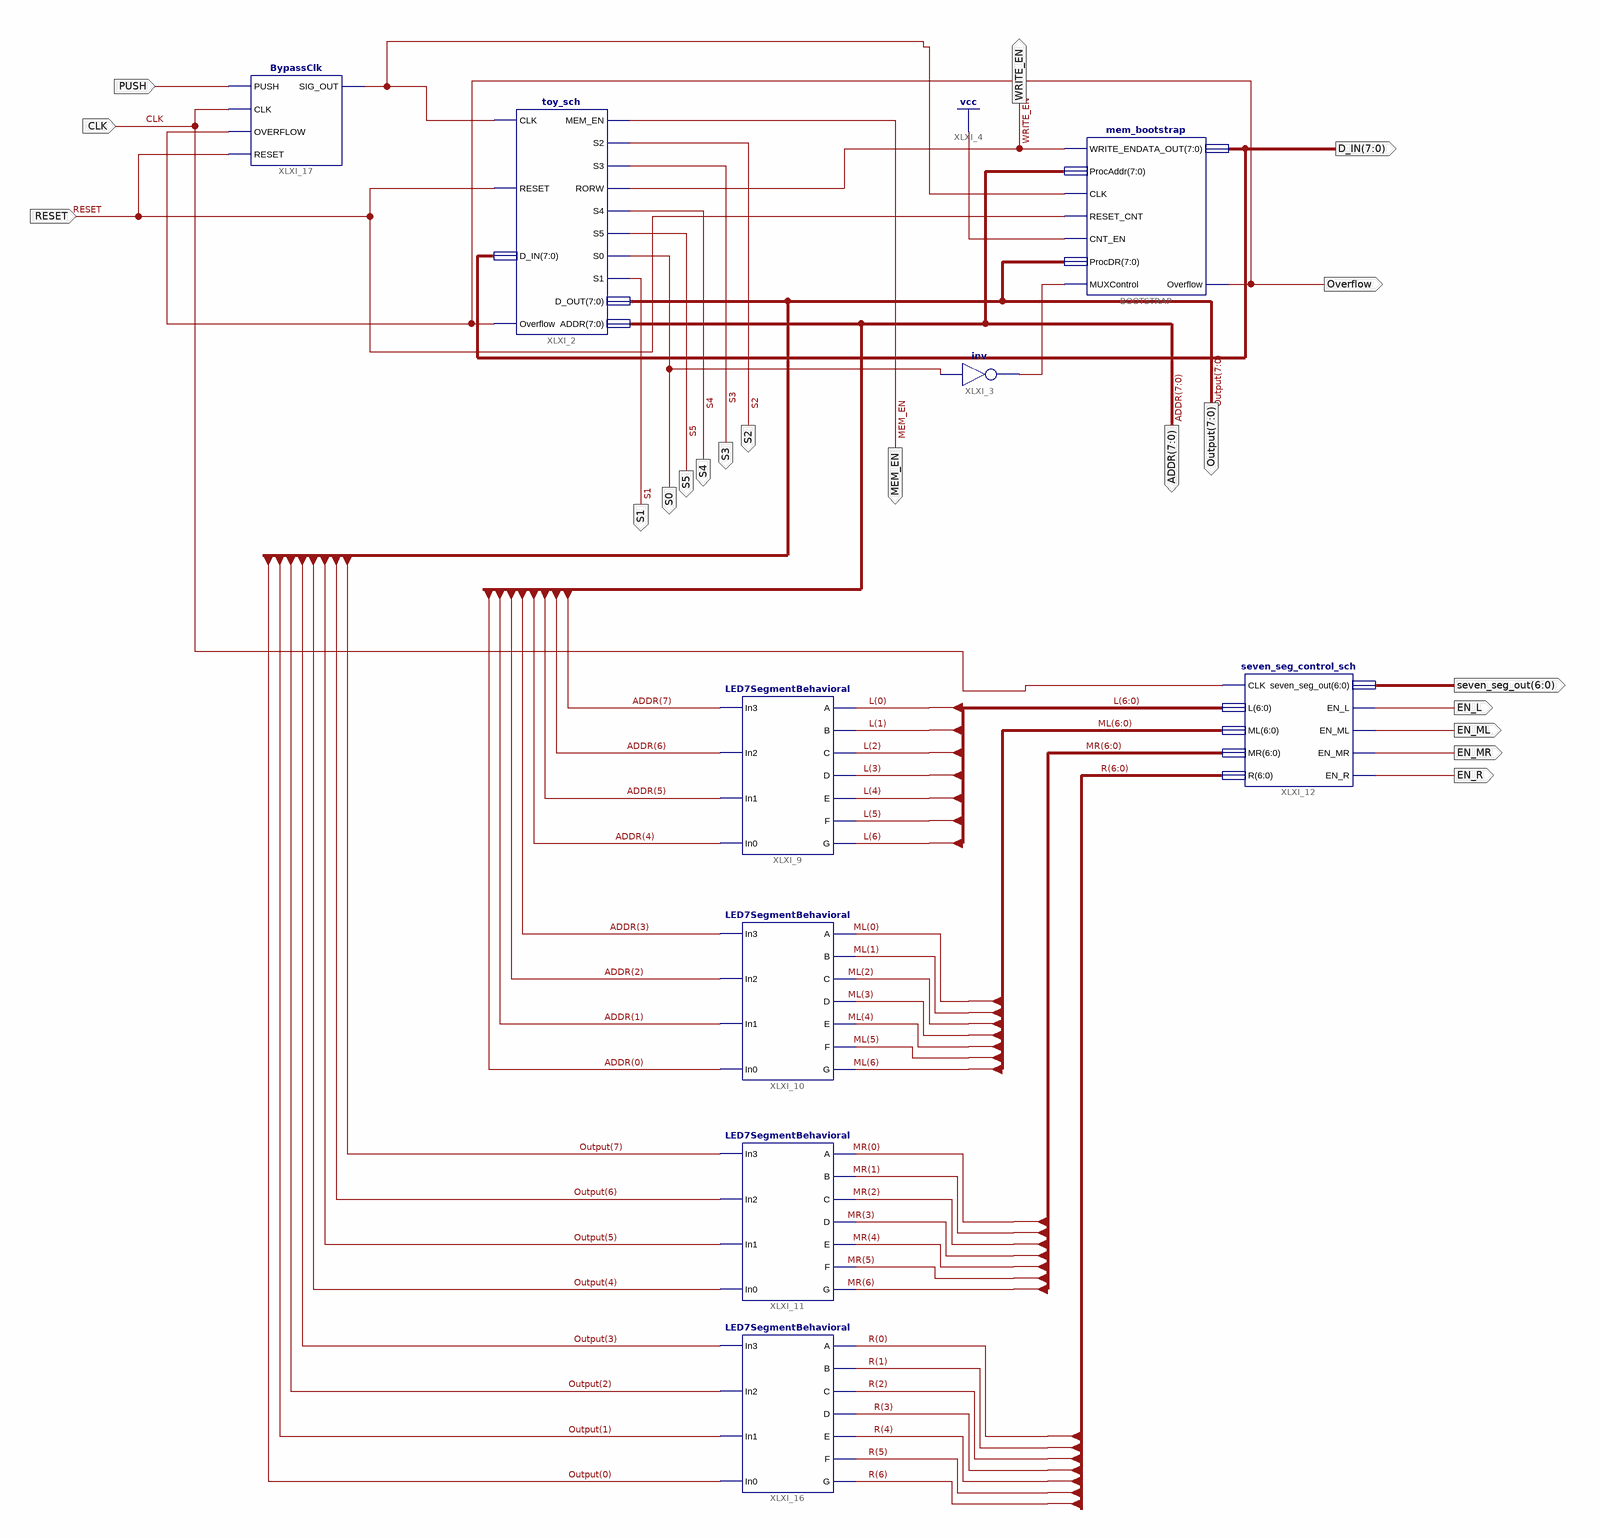
[diagram p0: schematic sheet 1]
// Xilinx ISE schematic toyProcessor_overall.sch (spartan3e) as structural Verilog: 9 symbols, 20 ports
module toyProcessor_overall (
  input  RESET,
  input  CLK,
  input  PUSH,
  output S2,
  output S3,
  output S4,
  output S5,
  output S1,
  output [7:0] ADDR,
  output Overflow,
  output WRITE_EN,
  output MEM_EN,
  output S0,
  output [7:0] D_IN,
  output [6:0] seven_seg_out,
  output EN_L,
  output EN_ML,
  output EN_MR,
  output EN_R,
  output [7:0] Output
);

  wire XLXN_20, XLXN_174;
  wire [6:0] L, ML, MR, R;

  BypassClk XLXI_17 (.CLK(CLK), .OVERFLOW(Overflow), .PUSH(PUSH), .RESET(RESET), .SIG_OUT(XLXN_174));
  mem_bootstrap BOOTSTRAP (
    .WRITE_EN(WRITE_EN), .ProcAddr(ADDR), .CLK(XLXN_174), .RESET_CNT(RESET), .CNT_EN(1'b1), .ProcDR(Output),
    .MUXControl(XLXN_20), .DATA_OUT(D_IN), .Overflow(Overflow));
  toy_sch XLXI_2 (
    .CLK(XLXN_174), .RESET(RESET), .D_IN(D_IN), .Overflow(Overflow), .MEM_EN(MEM_EN), .S2(S2), .S3(S3),
    .RORW(WRITE_EN), .S4(S4), .S5(S5), .S0(S0), .S1(S1), .D_OUT(Output), .ADDR(ADDR));
  not XLXI_3 (XLXN_20, S0);
  LED7SegmentBehavioral XLXI_9 (
    .In3(ADDR[7]), .In2(ADDR[6]), .In1(ADDR[5]), .In0(ADDR[4]), .A(L[0]), .B(L[1]), .C(L[2]), .D(L[3]),
    .E(L[4]), .F(L[5]), .G(L[6]));
  LED7SegmentBehavioral XLXI_10 (
    .In3(ADDR[3]), .In2(ADDR[2]), .In1(ADDR[1]), .In0(ADDR[0]), .A(ML[0]), .B(ML[1]), .C(ML[2]), .D(ML[3]),
    .E(ML[4]), .F(ML[5]), .G(ML[6]));
  LED7SegmentBehavioral XLXI_11 (
    .In3(Output[7]), .In2(Output[6]), .In1(Output[5]), .In0(Output[4]), .A(MR[0]), .B(MR[1]), .C(MR[2]),
    .D(MR[3]), .E(MR[4]), .F(MR[5]), .G(MR[6]));
  seven_seg_control_sch XLXI_12 (
    .CLK(CLK), .L(L), .ML(ML), .MR(MR), .R(R), .EN_L(EN_L), .EN_ML(EN_ML), .EN_R(EN_R), .EN_MR(EN_MR),
    .seven_seg_out(seven_seg_out));
  LED7SegmentBehavioral XLXI_16 (
    .In3(Output[3]), .In2(Output[2]), .In1(Output[1]), .In0(Output[0]), .A(R[0]), .B(R[1]), .C(R[2]),
    .D(R[3]), .E(R[4]), .F(R[5]), .G(R[6]));
endmodule
